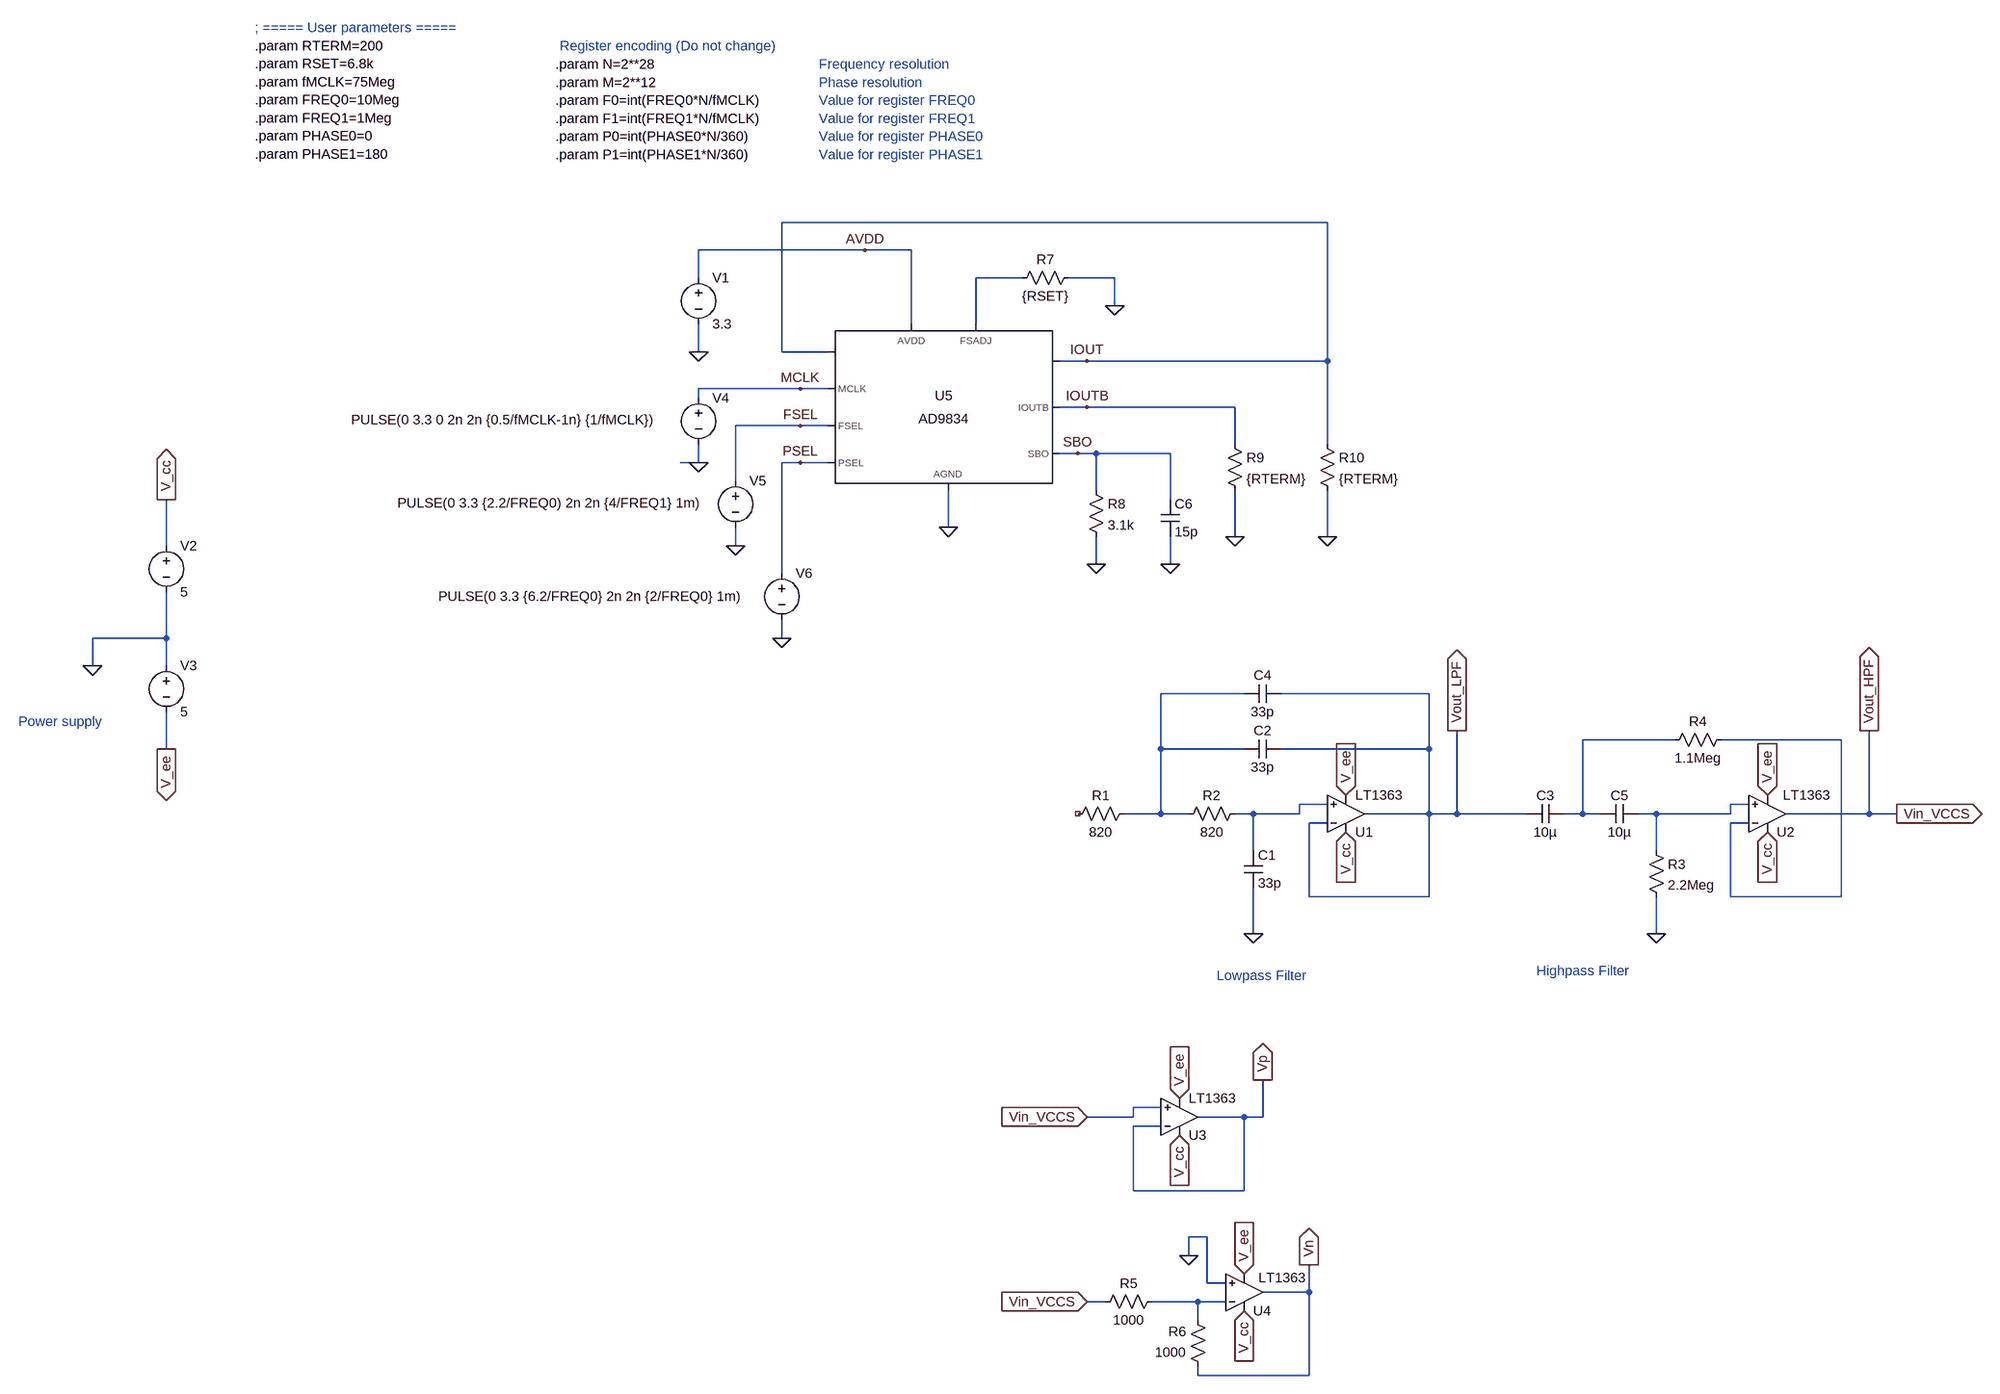
[diagram p0: schematic Filter.asc]
Filter.asc, the LTspice schematic file:
Version 4.1
SHEET 1 1772 1356
WIRE 592 -960 -352 -960
WIRE -208 -912 -496 -912
WIRE -128 -912 -208 -912
WIRE -496 -864 -496 -912
WIRE 64 -864 -16 -864
WIRE 224 -864 144 -864
WIRE 224 -816 224 -864
WIRE -128 -784 -128 -912
WIRE -16 -784 -16 -864
WIRE -496 -736 -496 -784
WIRE -352 -736 -352 -960
WIRE -272 -736 -352 -736
WIRE 176 -720 128 -720
WIRE 592 -720 592 -960
WIRE 592 -720 176 -720
WIRE -320 -672 -496 -672
WIRE -272 -672 -320 -672
WIRE -496 -656 -496 -672
WIRE 176 -640 128 -640
WIRE 432 -640 176 -640
WIRE -320 -608 -432 -608
WIRE -272 -608 -320 -608
WIRE 432 -576 432 -640
WIRE 592 -576 592 -720
WIRE 160 -560 128 -560
WIRE 192 -560 160 -560
WIRE 320 -560 192 -560
WIRE -496 -544 -496 -576
WIRE -496 -544 -528 -544
WIRE -320 -544 -352 -544
WIRE -272 -544 -320 -544
WIRE -432 -512 -432 -608
WIRE 192 -496 192 -560
WIRE 320 -480 320 -560
WIRE -64 -432 -64 -496
WIRE 432 -416 432 -496
WIRE 592 -416 592 -496
WIRE -1552 -400 -1552 -480
WIRE -432 -400 -432 -432
WIRE 192 -368 192 -416
WIRE 320 -368 320 -416
WIRE -352 -352 -352 -544
WIRE -1552 -240 -1552 -320
WIRE -1552 -240 -1680 -240
WIRE -352 -240 -352 -272
WIRE -1680 -192 -1680 -240
WIRE -1552 -192 -1552 -240
WIRE 448 -144 304 -144
WIRE 768 -144 512 -144
WIRE 1200 -64 1040 -64
WIRE 1488 -64 1280 -64
WIRE -1552 -48 -1552 -112
WIRE 304 -48 304 -144
WIRE 448 -48 304 -48
WIRE 768 -48 768 -144
WIRE 768 -48 512 -48
WIRE 592 48 544 48
WIRE 1328 48 1296 48
WIRE 304 64 304 -48
WIRE 304 64 240 64
WIRE 352 64 304 64
WIRE 464 64 432 64
WIRE 544 64 544 48
WIRE 544 64 464 64
WIRE 768 64 768 -48
WIRE 768 64 656 64
WIRE 816 64 816 -80
WIRE 816 64 768 64
WIRE 944 64 816 64
WIRE 1040 64 1040 -64
WIRE 1040 64 1008 64
WIRE 1072 64 1040 64
WIRE 1168 64 1136 64
WIRE 1296 64 1296 48
WIRE 1296 64 1168 64
WIRE 1536 64 1536 -80
WIRE 1536 64 1392 64
WIRE 1584 64 1536 64
WIRE 592 80 560 80
WIRE 1328 80 1296 80
WIRE 464 128 464 64
WIRE 1168 128 1168 64
WIRE 560 208 560 80
WIRE 768 208 768 64
WIRE 768 208 560 208
WIRE 1296 208 1296 80
WIRE 1488 208 1488 -64
WIRE 1488 208 1296 208
WIRE 464 272 464 192
WIRE 1168 272 1168 208
WIRE 304 688 256 688
WIRE 256 704 256 688
WIRE 256 704 176 704
WIRE 448 704 368 704
WIRE 480 704 480 640
WIRE 480 704 448 704
WIRE 304 720 256 720
WIRE 256 832 256 720
WIRE 448 832 448 704
WIRE 448 832 256 832
WIRE 384 912 352 912
WIRE 352 944 352 912
WIRE 384 992 384 912
WIRE 416 992 384 992
WIRE 560 1008 560 960
WIRE 560 1008 480 1008
WIRE 208 1024 176 1024
WIRE 368 1024 288 1024
WIRE 416 1024 368 1024
WIRE 368 1056 368 1024
WIRE 368 1152 368 1136
WIRE 560 1152 560 1008
WIRE 560 1152 368 1152
FLAG 464 272 0
FLAG -1680 -192 0
FLAG -1552 -480 V_cc
IOPIN -1552 -480 Out
FLAG -1552 -48 V_ee
IOPIN -1552 -48 Out
FLAG 624 32 V_ee
IOPIN 624 32 In
FLAG 624 96 V_cc
IOPIN 624 96 In
FLAG 816 -80 Vout_LPF
IOPIN 816 -80 Out
FLAG 1360 96 V_cc
IOPIN 1360 96 In
FLAG 1360 32 V_ee
IOPIN 1360 32 In
FLAG 1536 -80 Vout_HPF
IOPIN 1536 -80 Out
FLAG 1168 272 0
FLAG 1584 64 Vin_VCCS
IOPIN 1584 64 Out
FLAG 176 704 Vin_VCCS
IOPIN 176 704 In
FLAG 336 736 V_cc
IOPIN 336 736 In
FLAG 336 672 V_ee
IOPIN 336 672 In
FLAG 480 640 Vp
IOPIN 480 640 Out
FLAG 176 1024 Vin_VCCS
IOPIN 176 1024 In
FLAG 352 944 0
FLAG 560 960 Vn
IOPIN 560 960 Out
FLAG 448 976 V_ee
IOPIN 448 976 In
FLAG 448 1040 V_cc
IOPIN 448 1040 In
FLAG -496 -736 0
FLAG -496 -544 0
FLAG -432 -400 0
FLAG -352 -240 0
FLAG -64 -432 0
FLAG 192 -368 0
FLAG 320 -368 0
FLAG 224 -816 0
FLAG 176 -720 IOUT
FLAG 176 -640 IOUTB
FLAG 160 -560 SBO
FLAG -320 -672 MCLK
FLAG -320 -608 FSEL
FLAG -320 -544 PSEL
FLAG -208 -912 AVDD
FLAG 592 -416 0
FLAG 432 -416 0
DATAFLAG -1552 -80 ""
DATAFLAG -1552 -208 ""
DATAFLAG -1552 -288 ""
DATAFLAG -1552 -448 ""
SYMBOL res 256 48 R90
WINDOW 0 0 56 VBottom 2
WINDOW 3 32 56 VTop 2
SYMATTR InstName R1
SYMATTR Value 820
SYMBOL res 448 48 R90
WINDOW 0 0 56 VBottom 2
WINDOW 3 32 56 VTop 2
SYMATTR InstName R2
SYMATTR Value 820
SYMBOL cap 448 128 R0
SYMATTR InstName C1
SYMATTR Value 33p
SYMBOL cap 512 -64 R90
WINDOW 0 0 32 VBottom 2
WINDOW 3 32 32 VTop 2
SYMATTR InstName C2
SYMATTR Value 33p
SYMBOL OpAmps\\LT1363 624 128 M180
SYMATTR InstName U1
SYMBOL voltage -1552 -416 R0
SYMATTR InstName V2
SYMATTR Value 5
SYMBOL voltage -1552 -208 R0
WINDOW 123 0 0 Left 0
WINDOW 39 0 0 Left 0
SYMATTR InstName V3
SYMATTR Value 5
SYMBOL OpAmps\\LT1363 1360 128 M180
WINDOW 3 27 96 Left 2
SYMATTR InstName U2
SYMBOL cap 512 -160 R90
WINDOW 0 0 32 VBottom 2
WINDOW 3 32 32 VTop 2
SYMATTR InstName C4
SYMATTR Value 33p
SYMBOL cap 1008 48 R90
WINDOW 0 0 32 VBottom 2
WINDOW 3 32 32 VTop 2
SYMATTR InstName C3
SYMATTR Value 10µ
SYMBOL cap 1136 48 R90
WINDOW 0 0 32 VBottom 2
WINDOW 3 32 32 VTop 2
SYMATTR InstName C5
SYMATTR Value 10µ
SYMBOL res 1152 112 R0
SYMATTR InstName R3
SYMATTR Value 2.2Meg
SYMBOL res 1296 -80 R90
WINDOW 0 0 56 VBottom 2
WINDOW 3 32 56 VTop 2
SYMATTR InstName R4
SYMATTR Value 1.1Meg
SYMBOL OpAmps\\LT1363 336 768 M180
SYMATTR InstName U3
SYMBOL res 304 1008 R90
WINDOW 0 0 56 VBottom 2
WINDOW 3 32 56 VTop 2
SYMATTR InstName R5
SYMATTR Value 1000
SYMBOL OpAmps\\LT1363 448 1072 M180
WINDOW 3 25 89 Left 2
SYMATTR InstName U4
SYMBOL res 384 1152 R180
WINDOW 0 36 76 Left 2
WINDOW 3 36 40 Left 2
SYMATTR InstName R6
SYMATTR Value 1000
SYMBOL DAC\\AD9834 -64 -640 R0
SYMATTR InstName U5
SYMATTR SpiceLine TYPE=0 COMP=1 PHASE0=PHASE0={P0} PHASE1=PHASE1={P1}
SYMATTR SpiceLine2 fMCLK={fMCLK} FREQ0=FREQ0={F0} FREQ1=FREQ1={F1}
SYMBOL voltage -496 -880 R0
WINDOW 123 0 0 Left 0
WINDOW 39 0 0 Left 0
SYMATTR InstName V1
SYMATTR Value 3.3
SYMBOL voltage -496 -672 R0
WINDOW 3 -601 54 Left 2
WINDOW 123 0 0 Left 0
WINDOW 39 0 0 Left 0
SYMATTR Value PULSE(0 3.3 0 2n 2n {0.5/fMCLK-1n} {1/fMCLK})
SYMATTR InstName V4
SYMBOL voltage -432 -528 R0
WINDOW 3 -585 54 Left 2
WINDOW 123 0 0 Left 0
WINDOW 39 0 0 Left 0
SYMATTR Value PULSE(0 3.3 {2.2/FREQ0) 2n 2n {4/FREQ1} 1m)
SYMATTR InstName V5
SYMBOL voltage -352 -368 R0
WINDOW 3 -594 56 Left 2
WINDOW 123 0 0 Left 0
WINDOW 39 0 0 Left 0
SYMATTR Value PULSE(0 3.3 {6.2/FREQ0} 2n 2n {2/FREQ0} 1m)
SYMATTR InstName V6
SYMBOL res 160 -880 R90
WINDOW 0 0 56 VBottom 2
WINDOW 3 32 56 VTop 2
SYMATTR InstName R7
SYMATTR Value {RSET}
SYMBOL res 176 -512 R0
SYMATTR InstName R8
SYMATTR Value 3.1k
SYMBOL cap 304 -480 R0
SYMATTR InstName C6
SYMATTR Value 15p
SYMBOL res 416 -592 R0
SYMATTR InstName R9
SYMATTR Value {RTERM}
SYMBOL res 576 -592 R0
SYMATTR InstName R10
SYMATTR Value {RTERM}
TEXT 400 344 Left 2 ;Lowpass Filter
TEXT 960 336 Left 2 ;Highpass Filter
TEXT -1808 -96 Left 2 ;Power supply
TEXT -1264 -1304 Left 2 !.param RTERM=200\n.param RSET=6.8k\n.param fMCLK=75Meg\n.param FREQ0=10Meg\n.param FREQ1=1Meg\n.param PHASE0=0\n.param PHASE1=180
TEXT -1264 -1336 Left 2 ;; ===== User parameters =====
TEXT -744 -1272 Left 2 !.param N=2**28\n.param M=2**12\n.param F0=int(FREQ0*N/fMCLK)\n.param F1=int(FREQ1*N/fMCLK)\n.param P0=int(PHASE0*N/360)\n.param P1=int(PHASE1*N/360)
TEXT -736 -1304 Left 2 ;Register encoding (Do not change)
TEXT -288 -1272 Left 2 ;Frequency resolution\nPhase resolution\nValue for register FREQ0\nValue for register FREQ1\nValue for register PHASE0\nValue for register PHASE1

The netlist it stands for:
* Filter.asc
R1 N002 NC_01 820
R2 N005 N002 820
C1 N005 0 33p
C2 Vout_LPF N002 33p
X§U1 N005 Vout_LPF V_cc V_ee Vout_LPF LT1363  ; pins In+ In- V+ V- OUT
V2 V_cc 0 5
V3 0 V_ee 5
X§U2 N006 N004 V_cc V_ee Vin_VCCS LT1363  ; pins In+ In- V+ V- OUT
C4 Vout_LPF N002 33p
C3 N003 Vout_LPF 10µ
C5 N006 N003 10µ
R3 N006 0 2.2Meg
R4 N004 N003 1.1Meg
X§U3 Vin_VCCS Vp V_cc V_ee Vp LT1363  ; pins In+ In- V+ V- OUT
R5 N007 Vin_VCCS 1000
X§U4 0 N007 V_cc V_ee Vn LT1363  ; pins In+ In- V+ V- OUT
R6 Vn N007 1000
X§U5 MCLK FSEL PSEL AVDD 0 N001 IOUT IOUTB SBO IOUT AD9834 TYPE=0 COMP=1 PHASE0=PHASE0={P0} PHASE1=PHASE1={P1} fMCLK={fMCLK} FREQ0=FREQ0={F0} FREQ1=FREQ1={F1}  ; pins MCLK FSEL PSEL AVDD AGND FSADJ ? IOUTB SBO ?
V1 AVDD 0 3.3
V4 MCLK 0 PULSE(0 3.3 0 2n 2n {0.5/fMCLK-1n} {1/fMCLK})
V5 FSEL 0 PULSE(0 3.3 {2.2/FREQ0) 2n 2n {4/FREQ1} 1m)
V6 PSEL 0 PULSE(0 3.3 {6.2/FREQ0} 2n 2n {2/FREQ0} 1m)
R7 0 N001 {RSET}
R8 SBO 0 3.1k
C6 SBO 0 15p
R9 IOUTB 0 {RTERM}
R10 IOUT 0 {RTERM}
* Lowpass Filter
* Highpass Filter
* Power supply
.param RTERM=200
.param RSET=6.8k
.param fMCLK=75Meg
.param FREQ0=10Meg
.param FREQ1=1Meg
.param PHASE0=0
.param PHASE1=180
* ; ===== User parameters =====
.param N=2**28
.param M=2**12
.param F0=int(FREQ0*N/fMCLK)
.param F1=int(FREQ1*N/fMCLK)
.param P0=int(PHASE0*N/360)
.param P1=int(PHASE1*N/360)
* Register encoding (Do not change)
* Frequency resolution
* Phase resolution
* Value for register FREQ0
* Value for register FREQ1
* Value for register PHASE0
* Value for register PHASE1
.lib LT1363.sub
.lib AD9834.sub
.backanno
.end